# Altium schematic sheet LD_driver.SchDoc
size 420 x 297 mm; Address1: Address1; Address2: Address2; Address3: Address3; Address4: Address4; DocumentNumber: *Э3; SheetNumber: 5; SheetTotal: 11; DocumentType: Схема электрическая *
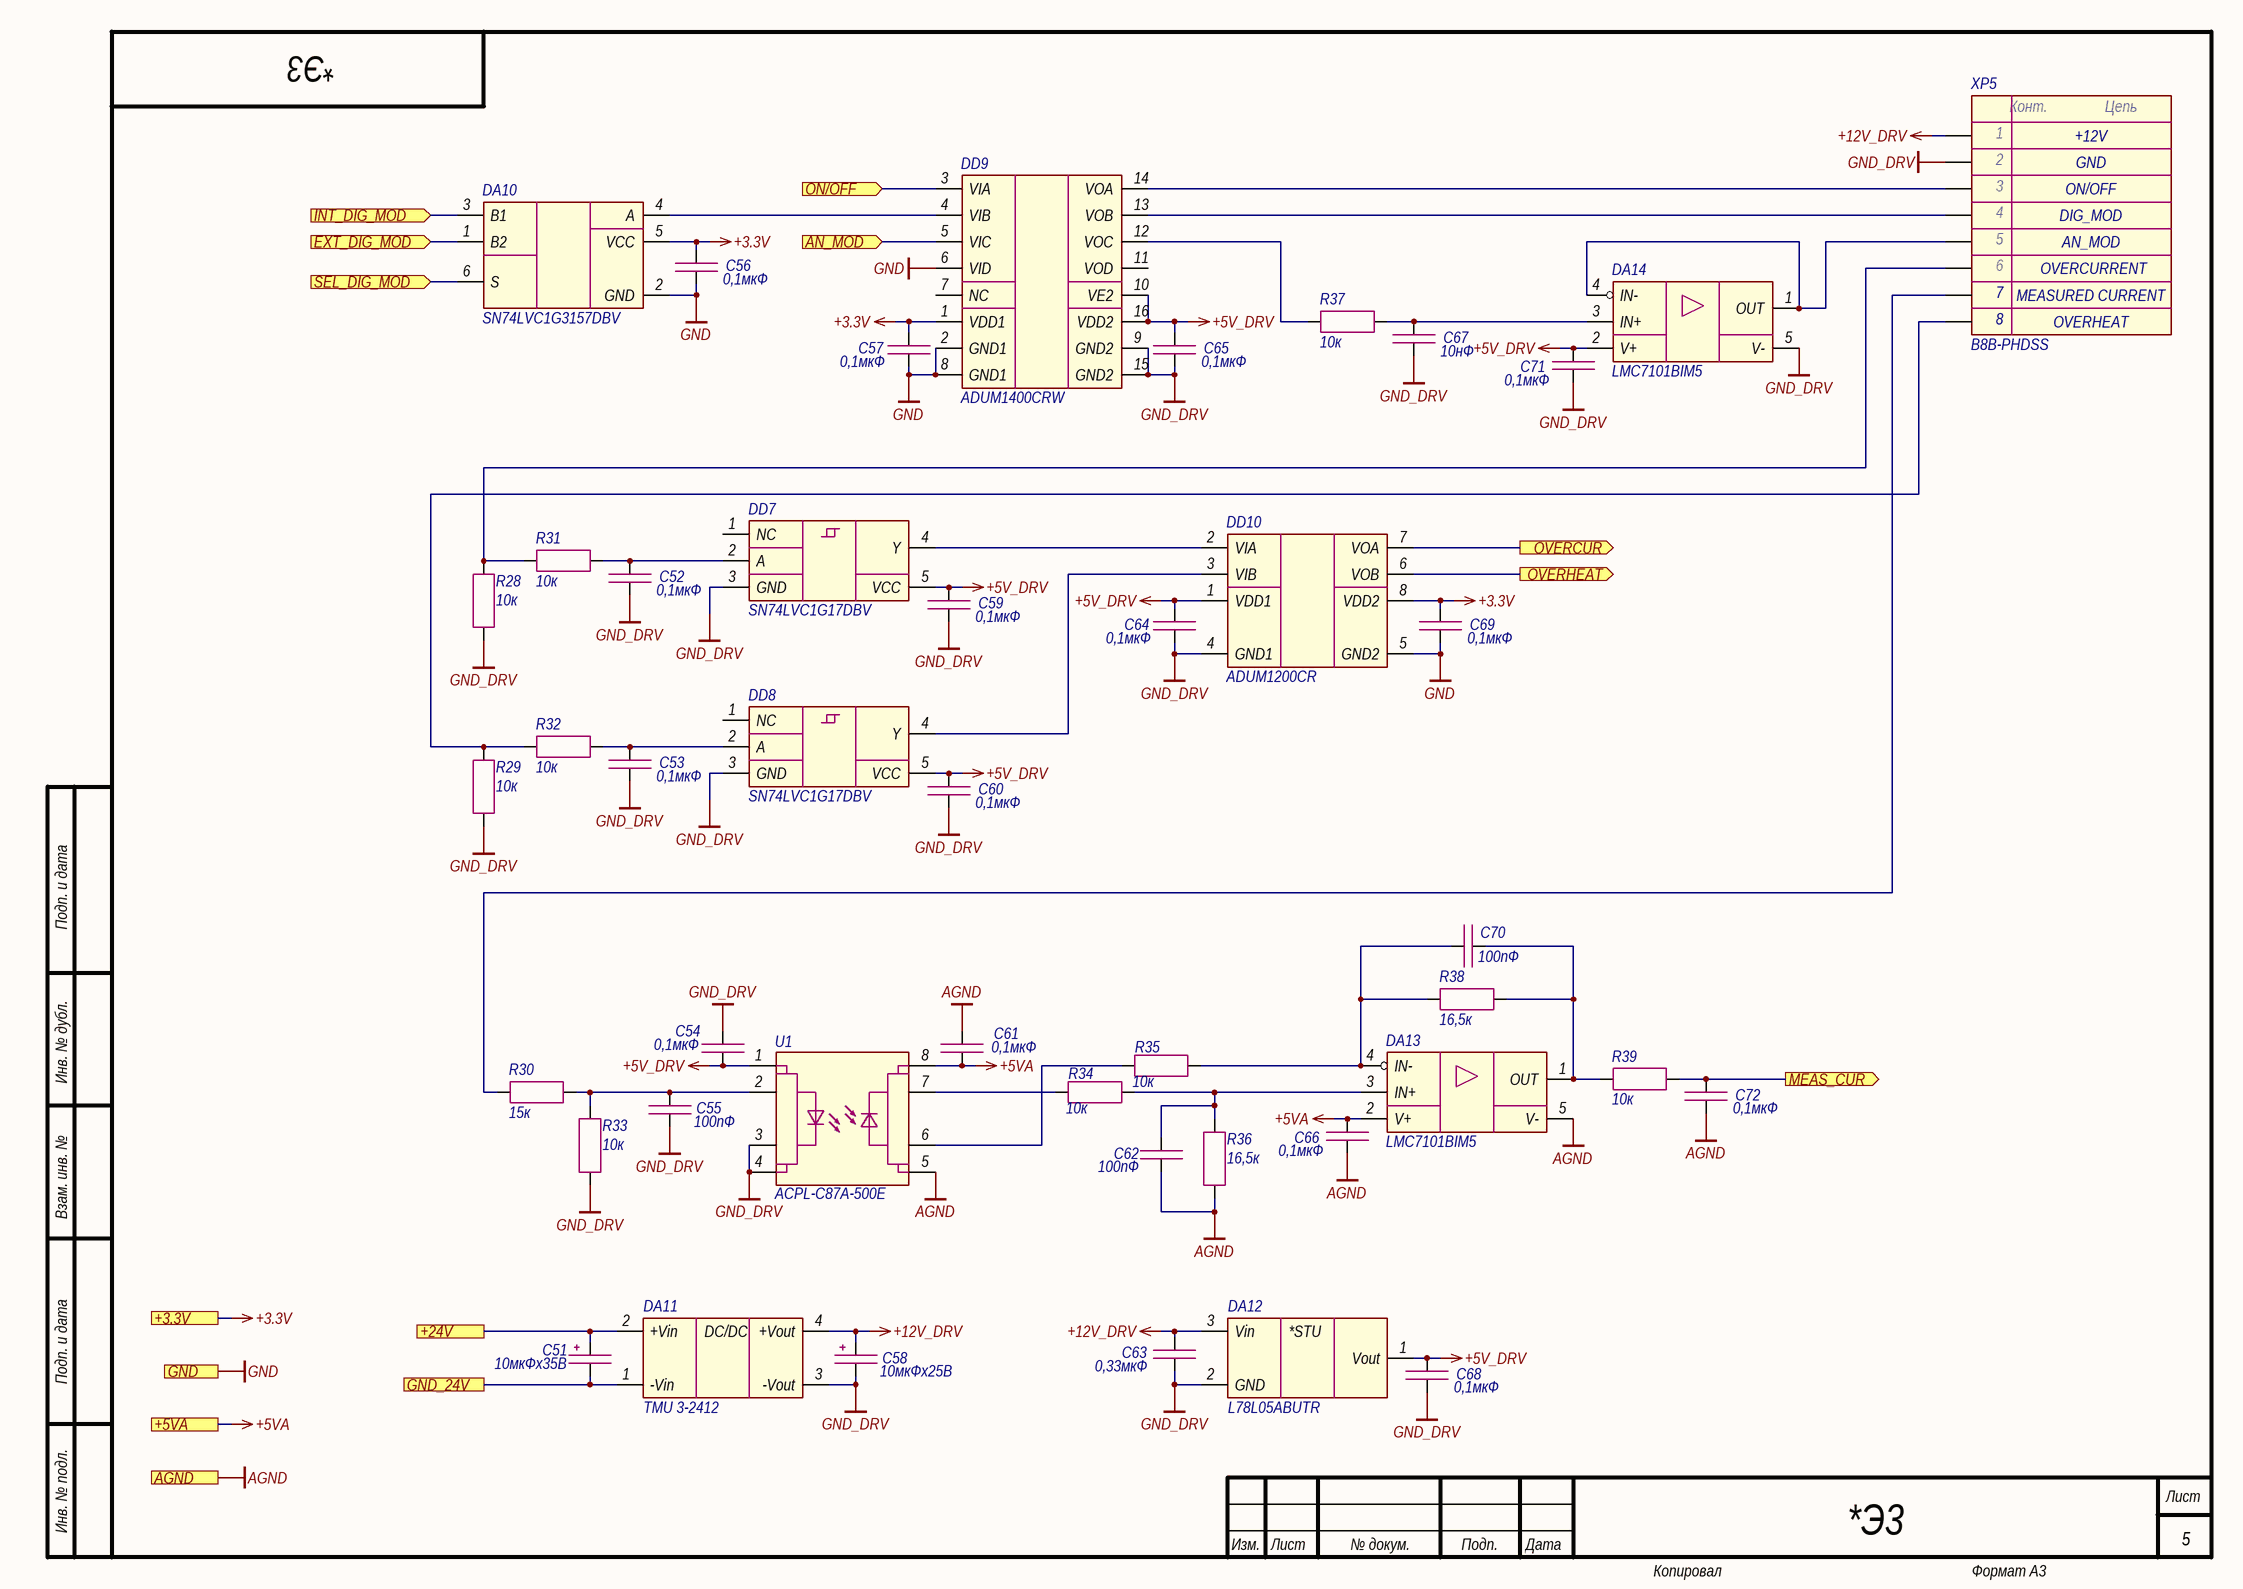
[diagram p0: LD_driver.SchDoc]

## Parts
C51  10мкФх35B  [CAP_C]
C52  0,1мкФ  [CAP_0603]
C53  0,1мкФ  [CAP_0603]
C54  0,1мкФ  [CAP_0603]
C55  100пФ  [CAP_0603]
C56  0,1мкФ  [CAP_0603]
C57  0,1мкФ  [CAP_0603]
C58  10мкФх25B  [CAP_B]
C59  0,1мкФ  [CAP_0603]
C60  0,1мкФ  [CAP_0603]
C61  0,1мкФ  [CAP_0603]
C62  100пФ  [CAP_0603]
C63  0,33мкФ  [CAP_0805]
C64  0,1мкФ  [CAP_0603]
C65  0,1мкФ  [CAP_0603]
C66  0,1мкФ  [CAP_0603]
C67  10нФ  [CAP_0603]
C68  0,1мкФ  [CAP_0603]
C69  0,1мкФ  [CAP_0603]
C70  100пФ  [CAP_0603]
C71  0,1мкФ  [CAP_0603]
C72  0,1мкФ  [CAP_0603]
DA10  SN74LVC1G3157DBV  [SOT-23-6]
DA11  TMU 3-2412  [TMU3 (SIP-4)]
DA12  L78L05ABUTR  [SOT-89]
DA13  LMC7101BIM5  [SOT-23-5]
DA14  LMC7101BIM5  [SOT-23-5]
DD7  SN74LVC1G17DBV  [SOT-23-5]
DD8  SN74LVC1G17DBV  [SOT-23-5]
DD9  ADUM1400CRW  [SOIC-16W]
DD10  ADUM1200CR  [SOIC-8]
R28  10к  [RES_0603]
R29  10к  [RES_0603]
R30  15к  [RES_0603]
R31  10к  [RES_0603]
R32  10к  [RES_0603]
R33  10к  [RES_0603]
R34  10к  [RES_0603]
R35  10к  [RES_0603]
R36  16,5к  [RES_0603]
R37  10к  [RES_0603]
R38  16,5к  [RES_0603]
R39  10к  [RES_0603]
U1  ACPL-C87A-500E  [SSO-8]
XP5  B8B-PHDSS  [B8B-PHDSS]

## Ports
+3.3V (see Main[2C], Ethernet[3D], Fiber_interlock[2C], Flow_sensor[2C], Hardwiring[3D], Power_supply[1D]), +5VA (see Main[2C], Hardwiring[4D], Photodiode[1C]), +24V (see Main[1C], Flow_sensor[2C], Hardwiring[3C], Indication[1C], Power_supply[1D]), AGND (see Main[2C], Hardwiring[4D], Photodiode[1D], Thermistor[2C]), AN_MOD (in, see Main[1C]), EXT_DIG_MOD (in, see Main[1C]), GND (see Main[2C], Ethernet[3D], Fiber_interlock[2C], Flow_sensor[2C], Guide_laser[1C], Hardwiring[3D], Indication[1C], Power_supply[1D]), GND_24V (see Main[1C], Flow_sensor[2C], Hardwiring[3C], Indication[1C], Power_supply[1D]), INT_DIG_MOD (in, see Main[1C]), MEAS_CUR (out, see Main[2C]), ON/OFF (in, see Main[1C]), OVERCUR (out, see Main[2C]), OVERHEAT (out, see Main[2C]), SEL_DIG_MOD (in, see Main[1C])

## Nets
+3.3V: C56.1 C57.1 C69.1 DA10.5(VCC) DD9.1(VDD1) DD10.8(VDD2) ; port +3.3V
+5V_DRV: C54.1 C59.1 C60.1 C64.1 C65.1 C68.1 C71.1 DA12.1(Vout) DA14.2(V+) DD7.5(VCC) DD8.5(VCC) DD9.10(VE2) DD9.16(VDD2) DD10.1(VDD1) U1.1(VDD1)
+5VA: C61.1 C66.1 DA13.2(V+) U1.8(VDD2) ; port +5VA
+12V_DRV: C58.1 C63.2 DA11.4(+Vout) DA12.3(Vin) XP5.1
AGND: C61.2 C62.2 C66.2 C72.2 DA13.5(V-) R36.2 U1.5(GND2) ; port AGND
GND: C56.2 C57.2 C69.2 DA10.2(GND) DD9.2(GND1) DD9.6(VID) DD9.8(GND1) DD10.5(GND2) ; port GND
GND_DRV: C52.2 C53.2 C54.2 C55.1 C58.2 C59.2 C60.2 C63.1 C64.2 C65.2 C67.2 C68.2 C71.2 DA11.3(-Vout) DA12.2(GND) DA14.5(V-) DD7.3(GND) DD8.3(GND) DD9.9(GND2) DD9.15(GND2) DD10.4(GND1) R28.1 R29.1 R33.2 U1.3(SHDN) U1.4(GND1) XP5.2
+24V: C51.1 DA11.2(+Vin) ; port +24V
AN_MOD: DD9.5(VIC) ; port AN_MOD
EXT_DIG_MOD: DA10.1(B2) ; port EXT_DIG_MOD
GND_24V: C51.2 DA11.1(-Vin) ; port GND_24V
INT_DIG_MOD: DA10.3(B1) ; port INT_DIG_MOD
MEAS_CUR: C72.1 R39.2 ; port MEAS_CUR
ON/OFF: DD9.3(VIA) ; port ON/OFF
OVERCUR: DD10.7(VOA) ; port OVERCUR
OVERHEAT: DD10.6(VOB) ; port OVERHEAT
SEL_DIG_MOD: DA10.6(S) ; port SEL_DIG_MOD
NetC52_1: C52.1 DD7.2(A) R31.2
NetC53_1: C53.1 DD8.2(A) R32.2
NetC55_2: C55.2 R30.1 R33.1 U1.2(VIN)
NetC62_1: C62.1 DA13.3(IN+) R34.2 R36.1
NetC67_1: C67.1 DA14.3(IN+) R37.2
NetC70_1: C70.1 DA13.4(IN-) R35.2 R38.2
NetC70_2: C70.2 DA13.1(OUT) R38.1 R39.1
NetDA10_4: DA10.4(A) DD9.4(VIB)
NetDA14_1: DA14.1(OUT) DA14.4(IN-) XP5.5
NetDD7_4: DD7.4(Y) DD10.2(VIA)
NetDD8_4: DD8.4(Y) DD10.3(VIB)
NetDD9_12: DD9.12(VOC) R37.1
NetDD9_13: DD9.13(VOB) XP5.4
NetDD9_14: DD9.14(VOA) XP5.3
NetR28_2: R28.2 R31.1 XP5.6
NetR29_2: R29.2 R32.1 XP5.8
NetR30_2: R30.2 XP5.7
NetR34_1: R34.1 U1.7(VOUT+)
NetR35_1: R35.1 U1.6(VOUT-)

Not connected (* = marked no-connect by the designer): DD7 1(NC); DD8 1(NC); DD9 7(NC) 11(VOD)

## Notes on the sheet
- ON/OFF
- +12V
- GND
- AN_MOD
- DIG_MOD
- OVERHEAT
- (near XP5) MEASURED CURRENT
- OVERCURRENT
- Подп. и дата
- Инв. № дубл.
- Взам. инв. №
- Инв. № подл.
- Изм.
- Лист
- № докум.
- Подп.
- Дата
- Копировал
- Формат А3
- (in symbol Connector-8) Конт.; Цепь
- (in symbol LD2981ABU50TR) *STU
- (in symbol TMU3) DC/DC

## Library data of the parts
C51 = Capacitor_Polar: Model: TECAP, 10 мкФ, 35 В, тип C, 10%; Value: 10мкФх35B; Document: *; Manufacturer: *
C52-C54 C56 C57 C59-C61 C64-C66 C68 C69 C71 C72 = Capacitor: Manufacturer: Murata; Model: GRM188R71H104KA93D; Value: 0,1мкФ; Document: *
C55 C62 C70 = Capacitor: Manufacturer: Murata; Model: GRM1885C1H101JA01D; Value: 100пФ; Document: *
C58 = Capacitor_Polar: Model: TECAP, 10 мкФ, 25 В, тип B, 10%; Value: 10мкФх25B; Document: *; Manufacturer: *
C63 = Capacitor: Manufacturer: Murata; Model: GRM219R71H334KA88D; Value: 0,33мкФ; Document: *
C67 = Capacitor: Manufacturer: Murata; Model: GRM188R71H103JA01D; Value: 10нФ; Document: *
DA10 = SN74LVC1G3157: Manufacturer: Texas Instruments; Model: SN74LVC1G3157DBV; Document: *
DA11 = TMU3: Manufacturer: Traco Power; Model: TMU 3-2412; Document: *
DA12 = LD2981ABU50TR: Manufacturer: STMicroelectronics; Model: L78L05ABUTR; Document: *
DA13 DA14 = LMC7101: Manufacturer: Texas Instruments; Model: LMC7101BIM5; Document: *
DD7 DD8 = SN74LVC1G17: Manufacturer: Texas Instruments; Model: SN74LVC1G17DBV; Document: *
DD9 = ADUM1400: Manufacturer: Analog Devices; Model: ADUM1400CRW; Document: *
DD10 = ADUM1200: Manufacturer: Analog Devices; Model: ADUM1200CR; Document: *
R28 R29 R31-R35 R37 R39 = Resistor: Manufacturer: Yageo; Model: RC0603FR-0710KL; Value: 10к; Document: *
R30 = Resistor: Manufacturer: Yageo; Model: RC0603FR-0715KL; Value: 15к; Document: *
R36 R38 = Resistor: Manufacturer: Yageo; Model: RC0603FR-0716K5L; Value: 16,5к; Document: *
U1 = ACPL-C87: Manufacturer: Broadcom; Model: ACPL-C87A-500E
XP5 = Connector-8: Manufacturer: JST; Model: B8B-PHDSS; Document: *